# Altium schematic sheet Fused Connections.SchDoc
size A; SheetNumber: 1; SheetTotal: 1
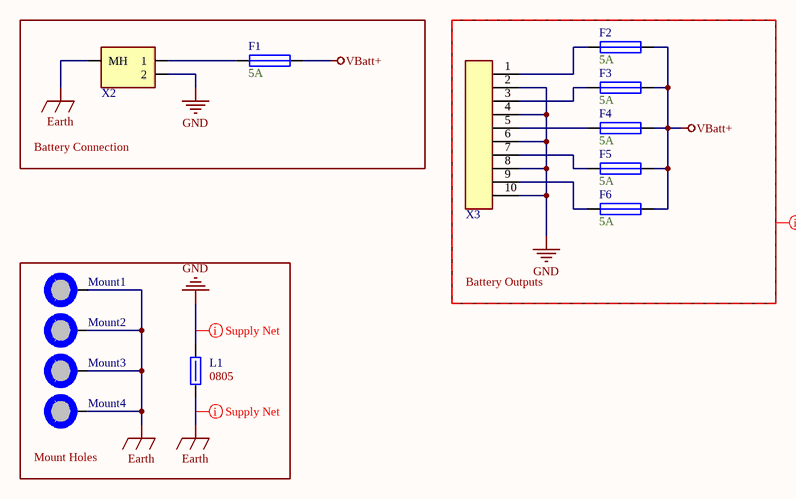
[diagram p0: Fused Connections.SchDoc]

## Parts
F1  Ampacity: 5A  [[Mount] (Mini) Automotive Mount]  (hidden comment: Mini)
F2  Ampacity: 5A  [[Mount] (Mini) Automotive Mount]  (hidden comment: Mini)
F3  Ampacity: 5A  [[Mount] (Mini) Automotive Mount]  (hidden comment: Mini)
F4  Ampacity: 5A  [[Mount] (Mini) Automotive Mount]  (hidden comment: Mini)
F5  Ampacity: 5A  [[Mount] (Mini) Automotive Mount]  (hidden comment: Mini)
F6  Ampacity: 5A  [[Mount] (Mini) Automotive Mount]  (hidden comment: Mini)
L1  Size Package: 0805  [[Ferrite] SMD 0805]  (hidden comment: 652-MH2029-300Y)
Mount1  M3 Mount Hole  [[Mount] M3 Mount Hole]  (value not drawn)  (no BOM)
Mount2  M3 Mount Hole  [[Mount] M3 Mount Hole]  (value not drawn)  (no BOM)
Mount3  M3 Mount Hole  [[Mount] M3 Mount Hole]  (value not drawn)  (no BOM)
Mount4  M3 Mount Hole  [[Mount] M3 Mount Hole]  (value not drawn)  (no BOM)
X2  Anderson 2pos Right-Angle  [[Anderson] 2pos Right-Angle 1327G17]  (value not drawn)
X3  10pin Screw Terminal  [[Screw Terminal] 10pin 5mm]  (value not drawn)

## Blocks framed on the sheet
Battery Connection: F1 X2
Battery Outputs: F2-F6 X3
Mount Holes: L1 Mount1-Mount4

## Nets
Earth: L1.1 Mount1.1 Mount2.1 Mount3.1 Mount4.1 X2.MH
GND: L1.2 X2.2 X3.2 X3.4 X3.6 X3.8 X3.10
VBatt+: F1.2 F2.2 F3.2 F4.2 F5.2 F6.2
NetF1_1: F1.1 X2.1
NetF2_1: F2.1 X3.1
NetF3_1: F3.1 X3.3
NetF4_1: F4.1 X3.5
NetF5_1: F5.1 X3.7
NetF6_1: F6.1 X3.9

## Layout directives
net class Supply_Nets: Earth, GND
net class Supply_Nets; rule Supply Nets [Voltage = 24.00]: GND, VBatt+

## Library data of the parts
F1-F6 = [Mount] (Mini) Automotive Mount: 3568; Supplier 1: DigiKey; Supplier Part Number 1: 36-3568-ND
L1 = [Ferrite] SMD 0805 3A 30ohm: Res @ Freq: 30 @ 100MHz; Supplier 1: DigiKey; Supplier Part Number 1: MH2029-300YCT-ND
Mount1-Mount4 = [Mount] M3 Mount Hole: Place at least 4.5mm from board edge. Plated.
X2 = [Anderson] 2pos Right-Angle
X3 = [Screw Terminal] 10pin: x5; Supplier 1: DigiKey; Supplier Part Number 1: 102-6145-ND